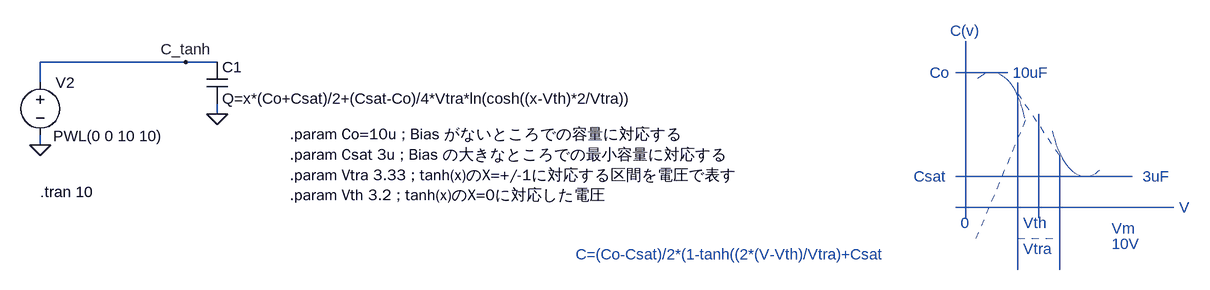
[diagram p0: schematic Fig_2-103_VdepndCap_tanh_DC.asc]
Fig_2-103_VdepndCap_tanh_DC.asc, the LTspice schematic file:
Version 4
SHEET 1 1988 680
WIRE 256 128 32 128
WIRE 304 128 256 128
WIRE 32 160 32 128
WIRE 304 208 304 192
WIRE 32 256 32 240
FLAG 304 208 0
FLAG 256 128 C_tanh
FLAG 32 256 0
SYMBOL cap 288 128 R0
SYMATTR InstName C1
SYMATTR Value Q=x*(Co+Csat)/2+(Csat-Co)/4*Vtra*ln(cosh((x-Vth)*2/Vtra))
SYMBOL voltage 32 144 R0
WINDOW 3 20 98 Left 2
WINDOW 123 0 0 Left 0
WINDOW 39 0 0 Left 0
SYMATTR Value PWL(0 0 10 10)
SYMATTR InstName V2
TEXT 32 328 Left 2 !.tran 10
TEXT 416 240 Left 2 !.param Co=10u ; Bias がないところでの容量に対応する\n.param Csat 3u ; Bias の大きなところでの最小容量に対応する\n.param Vtra 3.33 ; tanh(x)のX=+/-1に対応する区間を電圧で表す\n.param Vth 3.2 ; tanh(x)のX=0に対応した電圧
TEXT 1528 144 Left 2 ;10uF
TEXT 1728 304 Left 2 ;3uF
TEXT 1432 80 Left 2 ;C(v)
TEXT 1784 352 Left 2 ;V
TEXT 1400 144 Left 2 ;Co
TEXT 1376 304 Left 2 ;Csat
TEXT 1680 384 Left 2 ;Vm
TEXT 1680 408 Left 2 ;10V
TEXT 856 424 Left 2 ;C=(Co-Csat)/2*(1-tanh((2*(V-Vth)/Vtra)+Csat
TEXT 1544 416 Left 2 ;Vtra
TEXT 1544 376 Left 2 ;Vth
TEXT 1448 376 Left 2 ;0
LINE Normal 1456 368 1456 96
LINE Normal 1776 352 1440 352
LINE Normal 1600 272 1536 176 2
LINE Normal 1712 304 1440 304
LINE Normal 1600 448 1600 272
LINE Normal 1520 144 1440 144
LINE Normal 1472 400 1552 208 3
LINE Normal 1536 448 1536 160
LINE Normal 1568 368 1568 208
LINE Normal 1536 400 1600 400 3
ARC Normal 1440 384 1552 144 1607 155 1468 125 2
ARC Normal 1696 64 1584 304 1529 293 1668 323 2

The netlist it stands for:
* Fig_2-103_VdepndCap_tanh_DC.asc
C1 C_tanh 0 Q=x*(Co+Csat)/2+(Csat-Co)/4*Vtra*ln(cosh((x-Vth)*2/Vtra))
V2 C_tanh 0 PWL(0 0 10 10)
.tran 10
.param Co=10u ; Bias がないところでの容量に対応する
.param Csat 3u ; Bias の大きなところでの最小容量に対応する
.param Vtra 3.33 ; tanh(x)のX=+/-1に対応する区間を電圧で表す
.param Vth 3.2 ; tanh(x)のX=0に対応した電圧
* 10uF
* 3uF
* C(v)
* V
* Co
* Csat
* Vm
* 10V
* C=(Co-Csat)/2*(1-tanh((2*(V-Vth)/Vtra)+Csat
* Vtra
* Vth
* 0
.backanno
.end